# Altium schematic sheet Half-Bridge Convertor.SchDoc
size 420 x 297 mm; SheetTotal: 1; PageSetup: Record=PageOptions|CenterHorizontal=True|CenterVertical=True|PrintScale=1.32|XCorrection=1.00|YCorrection=1.00|PrintKind=0|BorderSize=5000000|LeftOffset=0|BottomOffset=0|Orientation=2|PaperLength=1000|PaperWidth=1000|Scale=100|PaperSource=260|PrintQuality=600|MediaType=1|DitherType=10|PaperKind=A3|PrintScaleMode=1; DocumentName: Э
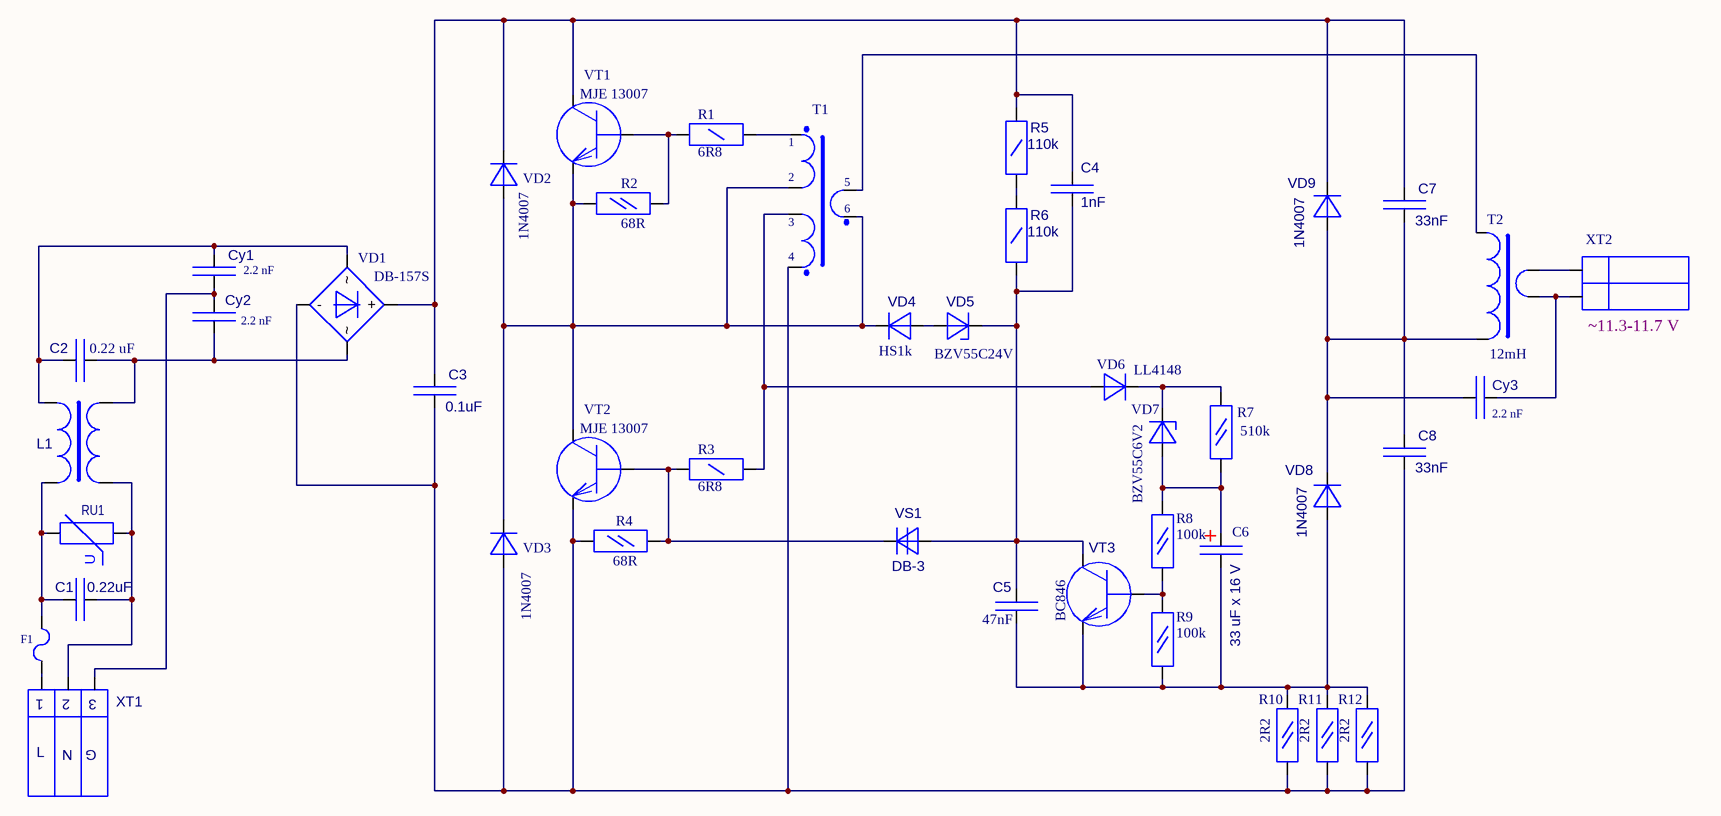
[diagram p0: Half-Bridge Convertor.SchDoc]

## Parts
C1  value 0.22uF  [CAPR9.0x18.0-15.0]  (hidden comment: Cap_MKP)
C2  value 0.22 uF  [CAPR9.0x18.0-15.0]  (hidden comment: Cap1)
C3  value 0.1uF  [CAPR5.0x13.0-7.5]  (hidden comment: Cap1)
C4  value 1nF  [CAPR5.0x13.0-5.0]  (hidden comment: Cap1)
C5  value 47nF  [CAPC2012 (0805)]  (hidden comment: Cap_SMD)
C6  value 33 uF x 16 V  [CAPR5-4X5]  (hidden comment: Cap Pol)
C7  value 33nF  [CAPR5.0x13.0-7.5]  (hidden comment: Cap1)
C8  value 33nF  [CAPR5.0x13.0-7.5]  (hidden comment: Cap1)
Cy1  value 2.2 nF  [CAPR Y - 7.5]  (hidden comment: Cap1)
Cy2  value 2.2 nF  [CAPR Y - 7.5]  (hidden comment: Cap1)
Cy3  value 2.2 nF  [CAPR Y - 7.5]  (hidden comment: Cap1)
F1  Fuse3  [Fuse - PCB]  (value not drawn)  (net tie, no BOM)
L1  Trans EMI  [YEE19-353D]  (value not drawn)
R1  value 6R8  [RESC3216(1206)N]  (hidden comment: Res 1/4W)
R2  value 68R  [RESC2012(0805)]  (hidden comment: Res 1/8W)
R3  value 6R8  [RESC3216(1206)N]  (hidden comment: Res 1/4W)
R4  value 68R  [RESC2012(0805)]  (hidden comment: Res 1/8W)
R5  value 110k  [RESC3216(1206)N]  (hidden comment: Res 1/4W)
R6  value 110k  [RESC3216(1206)N]  (hidden comment: Res 1/4W)
R7  value 510k  [RESC2012(0805)]  (hidden comment: Res 1/8W)
R8  value 100k  [RESC2012(0805)]  (hidden comment: Res 1/8W)
R9  value 100k  [RESC2012(0805)]  (hidden comment: Res 1/8W)
R10  value 2R2  [RESC2012(0805)]  (hidden comment: Res 1/8W)
R11  value 2R2  [RESC2012(0805)]  (hidden comment: Res 1/8W)
R12  value 2R2  [RESC2012(0805)]  (hidden comment: Res 1/8W)
RU1  Varistor  [VAristor 7.5-11x5]  (value not drawn)
T1  Trans TR  [ITK1005M100]  (value not drawn)
T2  Value2: 12mH  [HLT-EV25-12mH-0-g]  (hidden comment: HLT-EV25-12mH-0-g)
VD1  value DB-157S  [DB-1S]  (hidden comment: Diode Bridge)
VD2  Value2: 1N4007  [CD4532-1812 (mod)]  (hidden comment: Diode HS1x)
VD3  Value2: 1N4007  [CD4532-1812 (mod)]  (hidden comment: Diode HS1x)
VD4  value HS1k  [CD4532-1812 (mod)]  (hidden comment: Diode HS1x)
VD5  value BZV55C24V  [MELF-D3516-1406]  (hidden comment: Diode Zener)
VD6  value LL4148  [MELF-D3516-1406]  (hidden comment: Diode LL4148)
VD7  value BZV55C6V2  [MELF-D3516-1406]  (hidden comment: Diode Zener)
VD8  value 1N4007  [CD4532-1812 (mod)]  (hidden comment: Diode1)
VD9  value 1N4007  [CD4532-1812 (mod)]  (hidden comment: Diode1)
VS1  value DB-3  [DIODE-0.4]  (hidden comment: Diac)
VT1  value MJE 13007  [TO-220-AB]  (hidden comment: MJE13007)
VT2  value MJE 13007  [TO-220-AB]  (hidden comment: MJE13007)
VT3  value BC846  [SOT-23_3D]  (hidden comment: BC847)
XT1  Connect x3  [ZIP-Ballast3]  (value not drawn)
XT2  Connect x2  [ZIP-Ballast2]  (value not drawn)

## Nets
NetC1_1: C1.1 L1.2(Sec-) RU1.1 XT1.2
NetC1_2: C1.2 F1.1 L1.3(Pri-) RU1.2
NetC2_1: C2.1 Cy1.2 L1.4(Pri+) VD1.1
NetC2_2: C2.2 Cy2.1 L1.1(Sec+) VD1.2
NetC3_1: C3.1 C8.1 R4.2 R10.1 R11.1 R12.1 T1.3(Sec2+) VD1.4(-) VD3.1 VT2.3(E)
NetC3_2: C3.2 C4.1 C7.2 R5.2 VD1.3(+) VD2.2 VD9.2 VT1.2(C)
NetC4_2: C4.2 C5.1 R6.1 VD5.2 VS1.1 VT3.3(C)
NetC5_2: C5.2 C6.2 R9.1 R10.2 R11.2 R12.2 VD8.1 VT3.2(E)
NetC6_1: C6.1 R7.1 R8.2 VD7.1
NetC7_1: C7.1 C8.2 Cy3.2 T2.4(Pri-) VD8.2 VD9.1
NetCy1_1: Cy1.1 Cy2.2 XT1.3
NetCy3_1: Cy3.1 T2.5(Sec-) XT2.1
NetF1_1: F1.1 XT1.1
NetR1_1: R1.1 R2.2 VT1.1(B)
NetR1_2: R1.2 T1.1(Sec1+)
NetR2_1: R2.1 T1.2(Pri+) T1.6(Sec1-) VD2.1 VD3.2 VD4.2 VT1.3(E) VT2.2(C)
NetR3_1: R3.1 R4.1 VS1.2 VT2.1(B)
NetR3_2: R3.2 T1.4(Sec2-) VD6.1
NetR5_1: R5.1 R6.2
NetR7_2: R7.2 VD6.2 VD7.2
NetR8_1: R8.1 R9.2 VT3.1(B)
NetT1_5: T1.5(Pri-) T2.2(Pri+)
NetT2_6: T2.6(Sec+) XT2.2
NetVD4_1: VD4.1 VD5.1

## Notes on the sheet
- (near T1) 1
- (near T1) 2
- (near T1) 3
- (near T1) 5
- (near T1) 6
- (near T1) 4
- (near XT2) ~11.3-11.7 V
- (near XT1) 1
- (near XT1) 2
- (near XT1) 3
- L
- N
- G
- Подп. дата
- Инв. № дубл.
- Взам. инв. №
- Подп. и дата
- Изм.
- Лист.
- № докум.
- Подп.
- Дата
- Лит.
- Масса
- Масштаб
- Разраб.
- Пров.
- Т. контр.
- Лист 1
- Листов
- 1:1
- Инв. № подп.
- Н. контр.
- Утв.
- (in symbol Varistor) U

## Library data of the parts
C1 = Cap_MKP: Cap DIP (MKP); Voltage: 275VAC/400VDV; Function: EMI Filter; Tolerance: 20%; Dielectric: Polypropylene (MKP) - X2 class; PackageDescription: Radial, Thru-Hole Body 9.0x18.0x18.0mm(WxLxH), Pin Spacing 15.0mm; Supplier 1: *; Supplier Part Number 1: *; Value2: 0.22uF
C2 = Cap1: Capacitor GOST; Part Number: MKP1J033305I; Voltage: 275 VAC; Function: EMI Capasitor, Class X 2; Tolerance: 10 %; Dielectrik: MKP-10; Value2: (0.1uF); PackageDescription: Radial Capacitor 2 Thru holes; Package Reference: *
C3 = Cap1: Capacitor GOST; Voltage: 400 VDC; PackageDescription: Radial Capacitor; Package Reference: Thru-Hole, Pin spacing 7.5mm; Function: *; Part Number: *; Tolerance %: *; Supplier: *; Supplier Part Number: *
C4 = Cap1: Capacitor GOST; Voltage: 400V; Tolerance: 10 %; Dielectrik: Polypropyline/Ceramic; PackageDescription: Radial Capacitor; Package Reference: Capacitor Thru-Hole Disk Body Pin Spacing 5.0 mm; Function: *; Part Number: *; Supplier: *; Supplier Part Number: *
C5 = Cap_SMD: Ceramic; Voltage: 50V; Tolerance %: 10%; Dielectric: X7R; PackageDescription: SMD CC0805; Function: *; Supplier: *; Supplier Part Number: *
C6 = Cap Pol: Cap Pol GOST; Tolerance: 10%; Function: Electrolytic Aluminum Capasitor; Supplier: *; PackageDescription: Radial, Thru-Hole Body 13.0x25.0 (DxH)mm, Pin Spacing 5.0mm
C7 C8 = Cap1: Capacitor GOST; Voltage: 630V; PackageDescription: Radial Capacitor; Package Reference: Thru-Hole, Pin spacing 7.5mm; Function: *; Part Number: *; Tolerance %: *; Supplier: *; Supplier Part Number: *
Cy1-Cy3 = Cap1: Capacitor GOST; Part Number: MKY22W12203D00; Voltage: 275 VAC; Function: Y-Cap; Tolerance: 5 %; Dielectrik: MKP-Y2; PackageDescription: Radial Capacitor; Package Reference: *
F1 = Fuse3: Fuse GOST
L1 = Trans EMI: Trans EMI (GOST); Function: EMI Filter; Value: YEE19-35D; PackageDescription: *
R1 R3 R5 R6 = Res 1/4W: Resistor GOST; Tolerance: 5%; PackageDescription: Chip Resistor, Body 3.2x1.6mm,; PackageReference: *; Function: *; Part Number: *
R2 R4 R8-R12 = Res 1/8W: Resistor GOST; PackageDescription: Surface Mount; PackageReference: R0805; Part Number: *; Function: *; Tolerance: *
R7 = Res 1/8W: Resistor GOST; Tolerance: 1%; PackageDescription: Chip Resistor, Body 2.0x1.3mm,; PackageReference: *; Part Number: *
RU1 = Varistor: Varistor GOST; Part Number: ERZ-V05D471; Function: Transient Suppressor; Value: *; PackageReference: Varistor, Thru-Hole, Disc; Body 11 x 5 mm (LxW max) Pin Spacing 7.5 mm (typ)
T1 = Trans TR: Trans TR GOST; Value: ITK1005M100; Function: *; PackageDescription: *
T2 = Choke HLT- 50W/12V: HLT-E25-12mH-0-g; Function: Choke HLT; PackageDescription: EV25-13-13; Value: HLT-EV25-12mH-0-g
VD1 = Diode Bridge: Diode Bridge GOST; PackageReference: *; PackageDescription: *; Part Number: *; Function: *; Supplier 1: Mouser; Supplier Part Number 1: 583-DB157SC
VD2 VD3 = Diode HS1x: Diode HS1x (GOST); Value: HS1k; Package Description: Chip Diode; Body 4.5 x 3.2 mm (LxW typ); Part Number: *; Function: *
VD4 = Diode HS1x: Diode HS1x (GOST); Package Description: Chip Diode; Body 4.5 x 3.2 mm (LxW typ); Part Number: *; Function: *
VD5 = Diode Zener: Diode Zener GOST; Function: Zener Diode 24V; PackageReference: *; PackageDescription: Metal Electrode Face (MELF) Diode; Body 3.5 x 1.7 mm (LxDia); Part Number: *
VD6 = Diode LL4148: Diode LL4148 (GOST); Package Description: Metal Electrode Face (MELF) Diode; Body 3.5 x 1.7 mm (LxDia); Part Number: *; Function: *
VD7 = Diode Zener: Diode Zener GOST; Function: Zener Diode 6.2V; PackageReference: *; PackageDescription: Metal Electrode Face (MELF) Diode; Body 3.5 x 1.7 mm (LxDia); Part Number: *
VD8 = Diode1: Diode GOST; Function: Diode Bridge; Part Number: *; PackageDescription: Chip Diode; Body 4.5 x 3.2 mm (LxW typ); PackageReference: *
VD9 = Diode1: Diode GOST; Part Number: *; PackageDescription: Chip Diode; Body 4.5 x 3.2 mm (LxW typ); PackageReference: *
VS1 = Diac: Diac GOST; Function: DIAC 28V; Part Number: *; PackageDescription: DO-41; PackageReference: *
VT1 VT2 = MJE13007: NPN_TO-220; Functioun: Hight Voltage Switch; PackageDescription: Thru Hole; PackageReference: TO-220; Part Number: *
VT3 = BC847: NPN_SOT23; PackageDescription: SOT-23; PackageReference: *; Functioun: *; Part Number: *
XT1 = Connect x3: Connect x3 GOST; Function: Input connector
XT2 = Connect x2: Connect x2 GOST